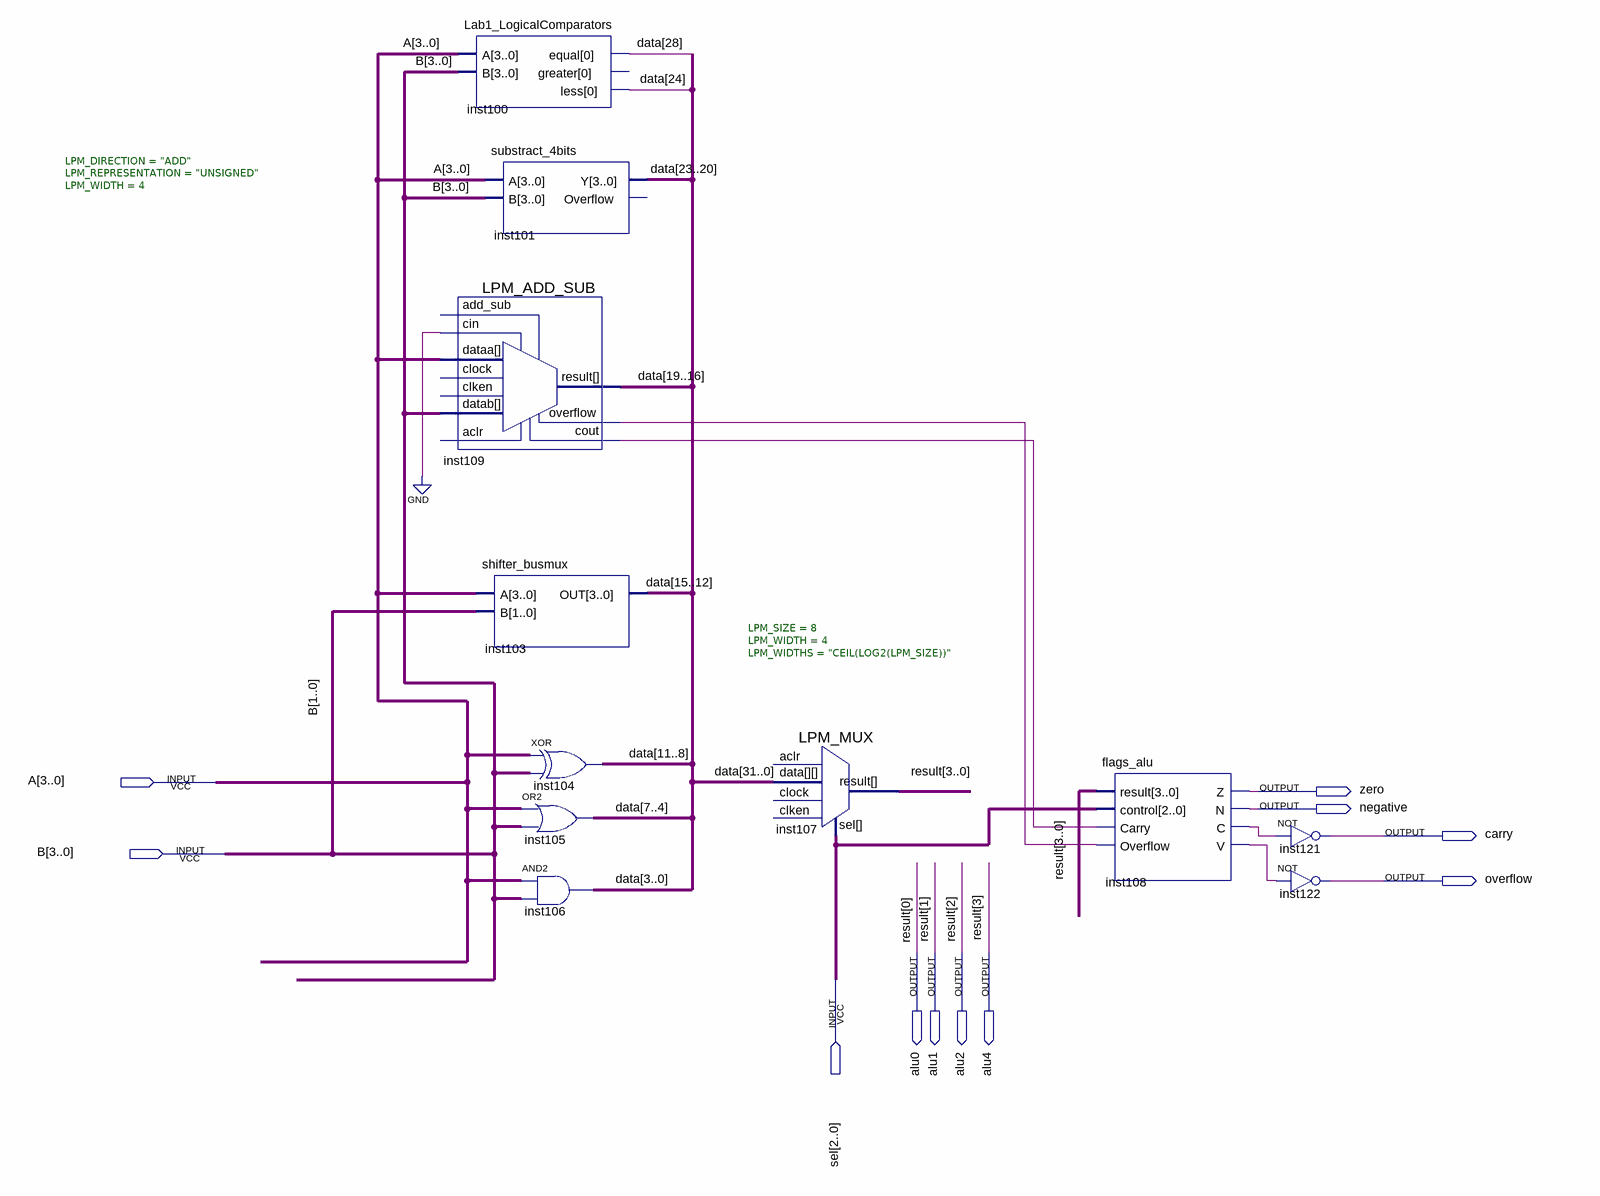
[diagram p0: schematic sheet]
// Quartus schematic ALU.bdf as structural Verilog: 11 symbols, 11 pins
module ALU (
  input  [3:0] A,
  input  [3:0] B,
  input  [2:0] sel,
  output zero,
  output negative,
  output carry,
  output overflow,
  output alu0,
  output alu1,
  output alu2,
  output alu4
);

  wire inst108_c, inst108_v, inst109_cout, inst109_overflow;
  wire [31:0] data;

  Lab1_LogicalComparators inst100 (.A(A), .B(B), .equal(data[28]), .less(data[24]));  // open: greater
  substract_4bits inst101 (.A(A), .B(B), .Y(data[23:20]));  // open: Overflow
  LPM_ADD_SUB #(.LPM_DIRECTION("ADD"), .LPM_REPRESENTATION("UNSIGNED"), .LPM_WIDTH(4)) inst109 (
    .datab(B), .dataa(A), .cin(1'b0), .cout(inst109_cout), .overflow(inst109_overflow), .result(data[19:16]));  // open: add_sub, aclr, clock, clken
  shifter_busmux inst103 (.A(A), .B(B[1:0]), .OUT(data[15:12]));
  assign data[11:8] = A ^ B;  // XOR inst104, 4 bits wide
  assign data[7:4] = A | B;  // OR2 inst105, 4 bits wide
  assign data[3:0] = A & B;  // AND2 inst106, 4 bits wide
  LPM_MUX #(.LPM_SIZE(8), .LPM_WIDTH(4), .LPM_WIDTHS("CEIL(LOG2(LPM_SIZE))")) inst107 (
    .data(data), .sel(sel), .result({alu4, alu2, alu1, alu0}));  // open: clock, aclr, clken
  flags_alu inst108 (
    .result({alu4, alu2, alu1, alu0}), .control(sel), .Carry(inst109_cout), .Overflow(inst109_overflow),
    .Z(zero), .N(negative), .C(inst108_c), .V(inst108_v));
  not inst121 (carry, inst108_c);
  not inst122 (overflow, inst108_v);

  // Other names for the same wires on the sheet: result[3:0] = {alu4, alu2, alu1, alu0}
endmodule
